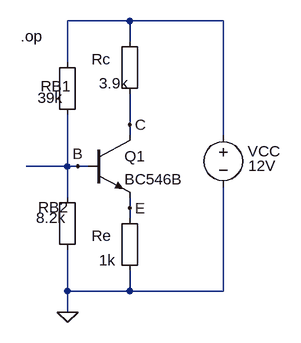
[diagram p0: schematic CE-DC.asc]
CE-DC.asc, the LTspice schematic file:
Version 4.1
SHEET 1 880 680
WIRE 192 -64 96 -64
WIRE 336 -64 192 -64
WIRE 192 -32 192 -64
WIRE 96 0 96 -64
WIRE 192 96 192 48
WIRE 192 112 192 96
WIRE 336 112 336 -64
WIRE 96 160 96 80
WIRE 96 160 32 160
WIRE 112 160 96 160
WIRE 128 160 112 160
WIRE 96 208 96 160
WIRE 192 224 192 208
WIRE 192 240 192 224
WIRE 96 352 96 288
WIRE 192 352 192 320
WIRE 192 352 96 352
WIRE 336 352 336 192
WIRE 336 352 192 352
WIRE 96 384 96 352
FLAG 96 384 0
FLAG 112 160 B
FLAG 192 96 C
FLAG 192 224 E
SYMBOL npn 128 112 R0
SYMATTR InstName Q1
SYMATTR Value BC546B
SYMBOL Misc\\EuropeanResistor 80 -16 R0
WINDOW 0 -25 53 Left 2
WINDOW 3 -30 70 Left 2
SYMATTR InstName RB1
SYMATTR Value 39k
SYMBOL Misc\\EuropeanResistor 176 -48 R0
WINDOW 0 -43 43 Left 2
WINDOW 3 -31 80 Left 2
SYMATTR InstName Rc
SYMATTR Value 3.9k
SYMBOL voltage 336 96 R0
WINDOW 0 38 41 Left 2
WINDOW 3 39 63 Left 2
WINDOW 123 0 0 Left 2
WINDOW 39 0 0 Left 2
SYMATTR InstName VCC
SYMATTR Value 12V
SYMBOL Misc\\EuropeanResistor 176 224 R0
WINDOW 0 -43 43 Left 2
WINDOW 3 -31 80 Left 2
SYMATTR InstName Re
SYMATTR Value 1k
SYMBOL Misc\\EuropeanResistor 80 192 R0
WINDOW 0 -29 31 Left 2
WINDOW 3 -32 47 Left 2
SYMATTR InstName RB2
SYMATTR Value 8.2k
TEXT 24 -40 Left 2 !.op

The netlist it stands for:
* CE-DC.asc
Q1 C B E 0 BC546B
RB1 N001 B 39k
Rc N001 C 3.9k
VCC N001 0 12V
Re E 0 1k
RB2 B 0 8.2k
.model NPN NPN
.model PNP PNP
.lib standard.bjt
.op
.backanno
.end